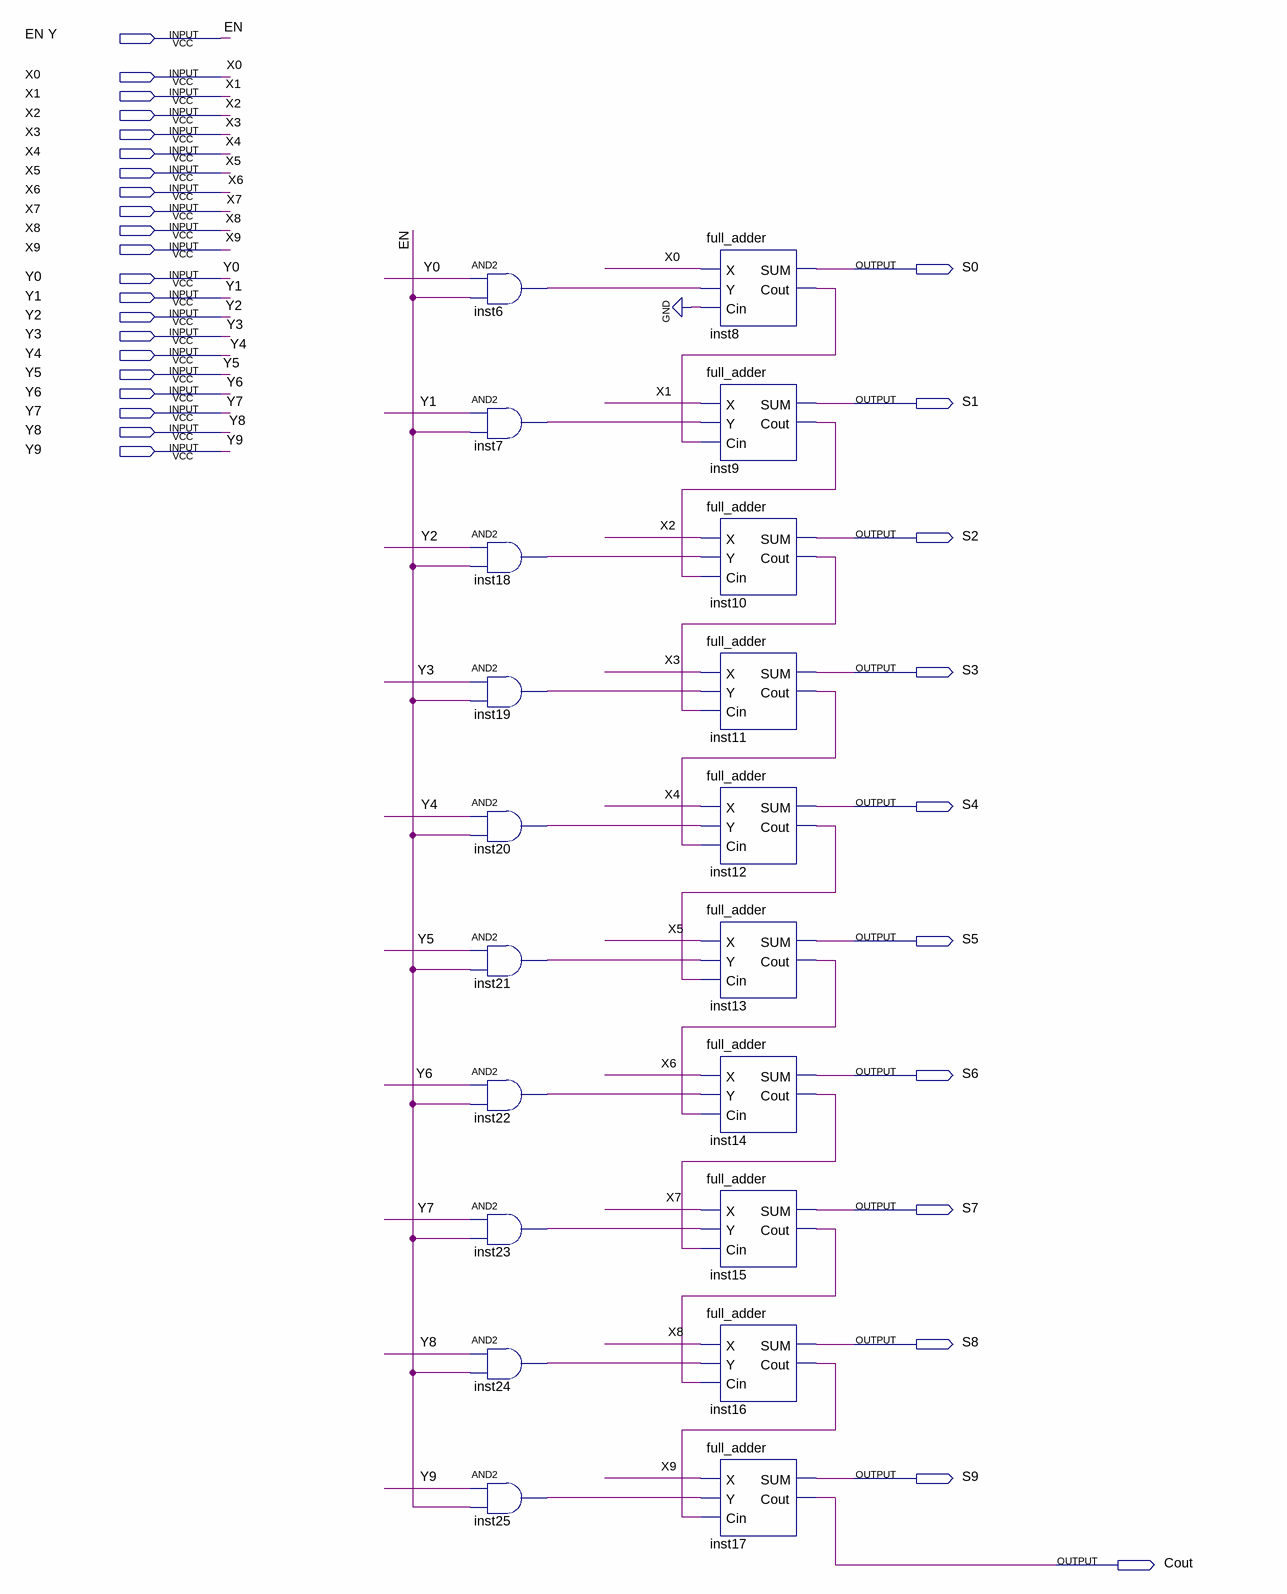
[diagram p0: schematic sheet]
// Quartus schematic ten_bit_adder_no_bus.bdf as structural Verilog: 20 symbols, 32 pins
module ten_bit_adder_no_bus (
  input  \EN_Y ,
  input  X0,
  input  X1,
  input  X2,
  input  X3,
  input  X4,
  input  X5,
  input  X6,
  input  X7,
  input  X8,
  input  X9,
  input  Y0,
  input  Y1,
  input  Y2,
  input  Y3,
  input  Y4,
  input  Y5,
  input  Y6,
  input  Y7,
  input  Y8,
  input  Y9,
  output S0,
  output S1,
  output S2,
  output S3,
  output S4,
  output S5,
  output S6,
  output S7,
  output S8,
  output S9,
  output Cout
);

  wire inst6_out, inst7_out, inst8_cout, inst9_cout, inst10_cout, inst11_cout, inst12_cout, inst13_cout,
       inst14_cout, inst15_cout, inst16_cout, inst18_out, inst19_out, inst20_out, inst21_out, inst22_out,
       inst23_out, inst24_out, inst25_out;

  and inst6 (inst6_out, Y0, \EN_Y );
  and inst7 (inst7_out, Y1, \EN_Y );
  and inst18 (inst18_out, Y2, \EN_Y );
  and inst19 (inst19_out, Y3, \EN_Y );
  and inst20 (inst20_out, Y4, \EN_Y );
  and inst21 (inst21_out, Y5, \EN_Y );
  and inst22 (inst22_out, Y6, \EN_Y );
  and inst23 (inst23_out, Y7, \EN_Y );
  and inst24 (inst24_out, Y8, \EN_Y );
  and inst25 (inst25_out, Y9, \EN_Y );
  full_adder inst8 (.X(X0), .Y(inst6_out), .Cin(1'b0), .SUM(S0), .Cout(inst8_cout));
  full_adder inst9 (.X(X1), .Y(inst7_out), .Cin(inst8_cout), .SUM(S1), .Cout(inst9_cout));
  full_adder inst10 (.X(X2), .Y(inst18_out), .Cin(inst9_cout), .SUM(S2), .Cout(inst10_cout));
  full_adder inst11 (.X(X3), .Y(inst19_out), .Cin(inst10_cout), .SUM(S3), .Cout(inst11_cout));
  full_adder inst12 (.X(X4), .Y(inst20_out), .Cin(inst11_cout), .SUM(S4), .Cout(inst12_cout));
  full_adder inst13 (.X(X5), .Y(inst21_out), .Cin(inst12_cout), .SUM(S5), .Cout(inst13_cout));
  full_adder inst14 (.X(X6), .Y(inst22_out), .Cin(inst13_cout), .SUM(S6), .Cout(inst14_cout));
  full_adder inst15 (.X(X7), .Y(inst23_out), .Cin(inst14_cout), .SUM(S7), .Cout(inst15_cout));
  full_adder inst16 (.X(X8), .Y(inst24_out), .Cin(inst15_cout), .SUM(S8), .Cout(inst16_cout));
  full_adder inst17 (.X(X9), .Y(inst25_out), .Cin(inst16_cout), .SUM(S9), .Cout(Cout));

  // Other names for the same wires on the sheet: EN = \EN_Y 
endmodule
